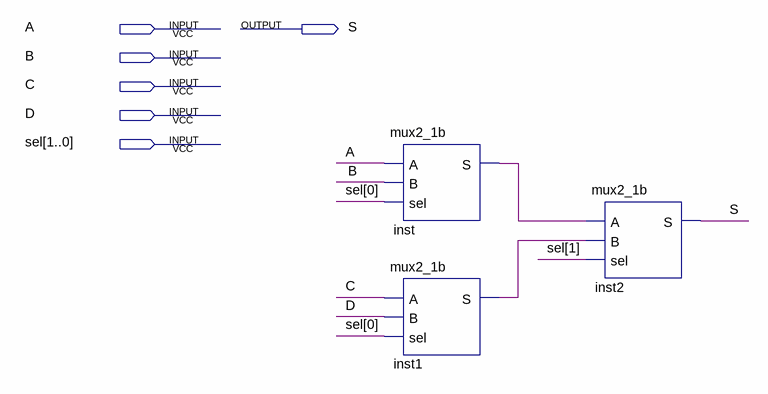
[diagram p0: schematic sheet]
// Quartus schematic mux4_1b.bdf as structural Verilog: 3 symbols, 6 pins
module mux4_1b (
  input  A,
  input  B,
  input  C,
  input  D,
  input  [1:0] sel,
  output S
);

  wire inst1_s, inst_s;

  mux2_1b inst (.A(A), .B(B), .sel(sel[0]), .S(inst_s));
  mux2_1b inst1 (.A(C), .B(D), .sel(sel[0]), .S(inst1_s));
  mux2_1b inst2 (.A(inst_s), .B(inst1_s), .sel(sel[1]), .S(S));
endmodule
